# EAGLE design ac_online_offline (EAGLE 8.2.0)
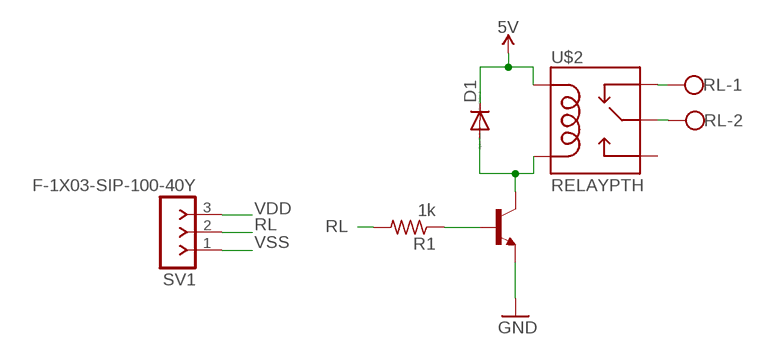
[diagram p0: schematic, sheet 1]

## Parts
D1  1N4148DO35-7  [DO35-7]
R1  1k  R-US_M1206  [M1206]
RL  W237-102  [W237-102]
SV1  F-1X03-SIP-100-40Y  [SIP-100-03-40Y]
T1  BC847  [SOT23]
U$2  RELAYPTH  [SRD-05VDC-SL-C]

## Nets
N$2: RL.2 U$2.SWCOMMON
N$3: RL.1 U$2.SWCLOSED(SWCLOSE)
N$5: D1.A T1.3(C) U$2.COIL0
N$6: R1.1 T1.1(B)
RL: R1.2 SV1.2
VDD: D1.C SV1.3 U$2.COIL1 ; supply symbol labelled 5V
VSS: SV1.1 T1.2(E) ; supply symbol labelled GND
Unconnected: U$2.SWOPEN

## Library data of the parts
D1 = diode:1N4148: DIODE high speed (Philips)
R1 = resistor:R-US_: RESISTOR, American symbol
RL = con-wago-500:W237-102: WAGO SCREW CLAMP; MPN: 237-102; OC_FARNELL: unknown; OC_NEWARK: 70K9898
SV1 = con-headers-jp:F-1X03-: FEMALE HEADER
T1 = transistor:BC847: NPN TRANSISTOR
U$2 = SRD-05VDC-SL-C:RELAY: SPDT relay (COM-00101)

## Board
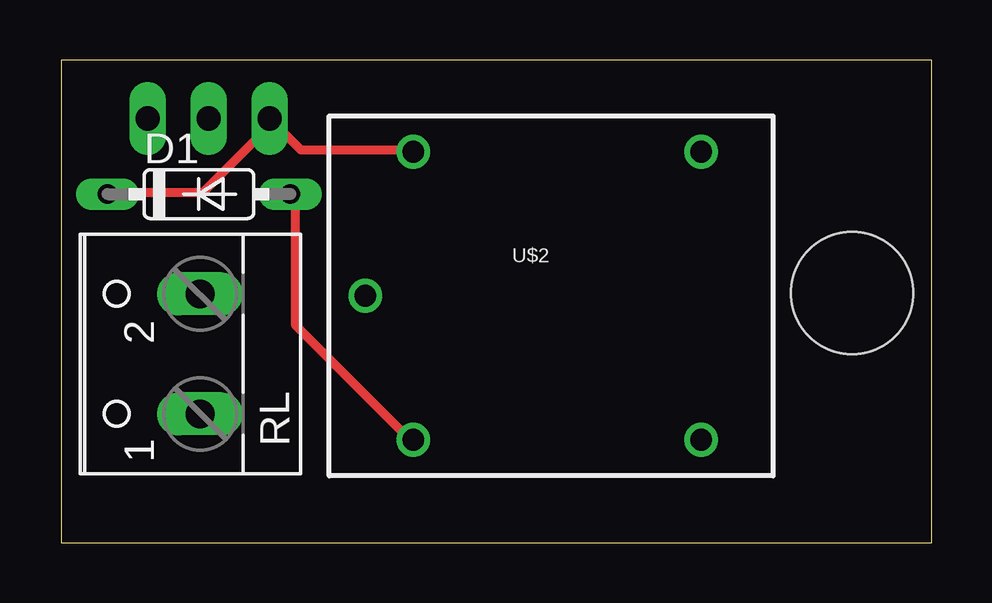
[diagram p1: board, top side]
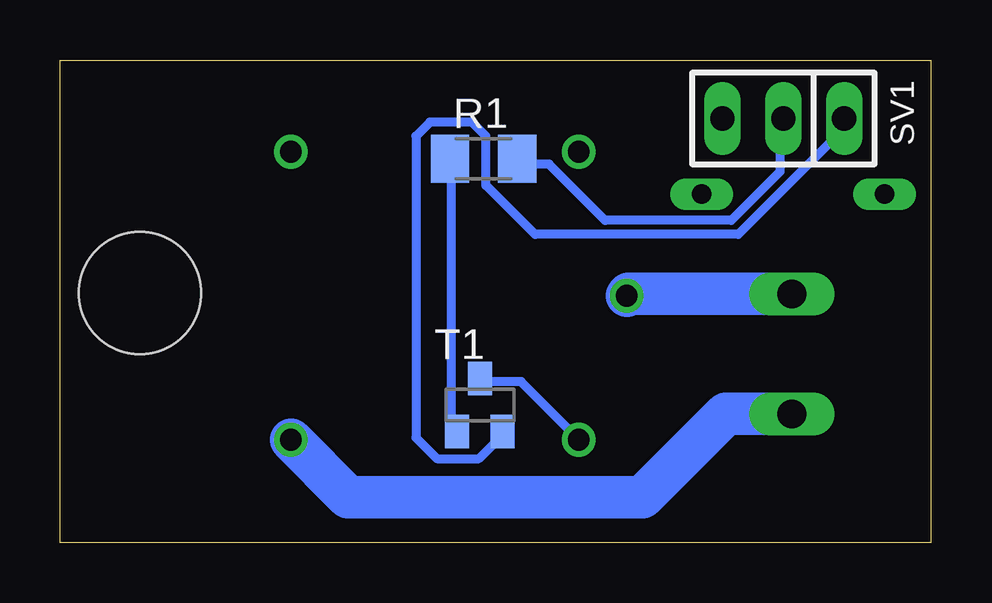
[diagram p2: board, bottom side, seen from below]

Size 36.3 x 20.12 mm. Coordinates in mm from the lower left corner, seen from the top.
Outline: 0,0 36.3,0 36.3,20.12 0,20.12 0,0
Copper layers (1*16): Top 0.035mm / dielectric 1.5mm / Bottom 0.035mm
Design rules "default *": minimum track width 15mil, minimum drill 24mil, track to track 8mil, track to pad 8mil, pad to pad 8mil, via to via 8mil, smd to smd 8mil, copper to edge 40mil, drill to drill 8mil, minimum pad ring 10mil, minimum via ring 8mil, stop-mask expansion 4mil, vias tented up to drill 0mil, thermal gap 10mil
Holes 5.08 mm at 32.97,10.41

### Footprints (pad centres in the part's own frame; a part is rotated, then mirrored left to right if it is on the bottom)
DO35-7 = drill 0.813 long: A 3.81,0; C -3.81,0
M1206 = smd 1.6 x 2: 1 -1.4,0; 2 1.4,0
W237-102 = drill 1.194 long: 1 -2.5,-1.27; 2 2.5,-1.27
SIP-100-03-40Y = drill 1.016 long: 1 -2.54,0; 2 0,0; 3 2.54,0
SOT23 = smd 1 x 1.4: 1 -0.95,-1.1; 2 0.95,-1.1; 3 0,1.1
SRD-05VDC-SL-C = drill 0.9: COIL0 -5.39,-6.12; COIL1 -5.39,5.88; SWCLOSED 6.61,-6.12; SWCOMMON -7.39,-0.12; SWOPEN 6.61,5.88

### Placement (x,y rotation side)
D1  5.74,14.53 0 top
R1  18.64,16 0 bottom
RL  4.52,7.87 90 top
SV1  6.15,17.68 180 bottom
T1  18.8,5.74 0 bottom
U$2  20.07,10.41 0 top

### Tracks (layer width: path | path; a pad name or v marks a point on that pad's centre or on a via)
N$2
  Bottom 1.778: RL.2 12.6,10.37 U$2.SWCOMMON
N$3
  Bottom 1.778: RL.1 8.55,5.37 12.01,1.91 24.29,1.91 U$2.SWCLOSED
N$5
  Top 0.381: D1.A 9.78,14.31 9.78,9.05 14.45,4.38 U$2.COIL0
  Bottom 0.381: T1.3 18.54,6.72 17.08,6.72 14.75,4.38 U$2.COIL0
N$6
  Bottom 0.381: T1.1 20,4.67 20,15.77 R1.1
RL
  Bottom 0.381: R1.2 17.08,15.77 15.91,15.77 13.58,13.44 8.32,13.44 6.27,15.48 6.27,17.55 SV1.2
VDD
  Top 0.381: D1.C 2.18,14.61 5.92,14.61 8.84,17.53 | U$2.COIL1 14.45,16.36 10.01,16.36 8.84,17.53 | 8.84,17.53 SV1.3
VSS
  Bottom 0.381: T1.2 17.96,4.38 18.83,3.5 20.59,3.5 21.46,4.38 21.46,16.94 20.88,17.53 19.13,17.53 18.54,16.94 18.54,14.9 16.5,12.85 8.03,12.85 3.61,17.27 SV1.1